# Altium schematic sheet 1608卡-原理图3.SchDoc
size A3
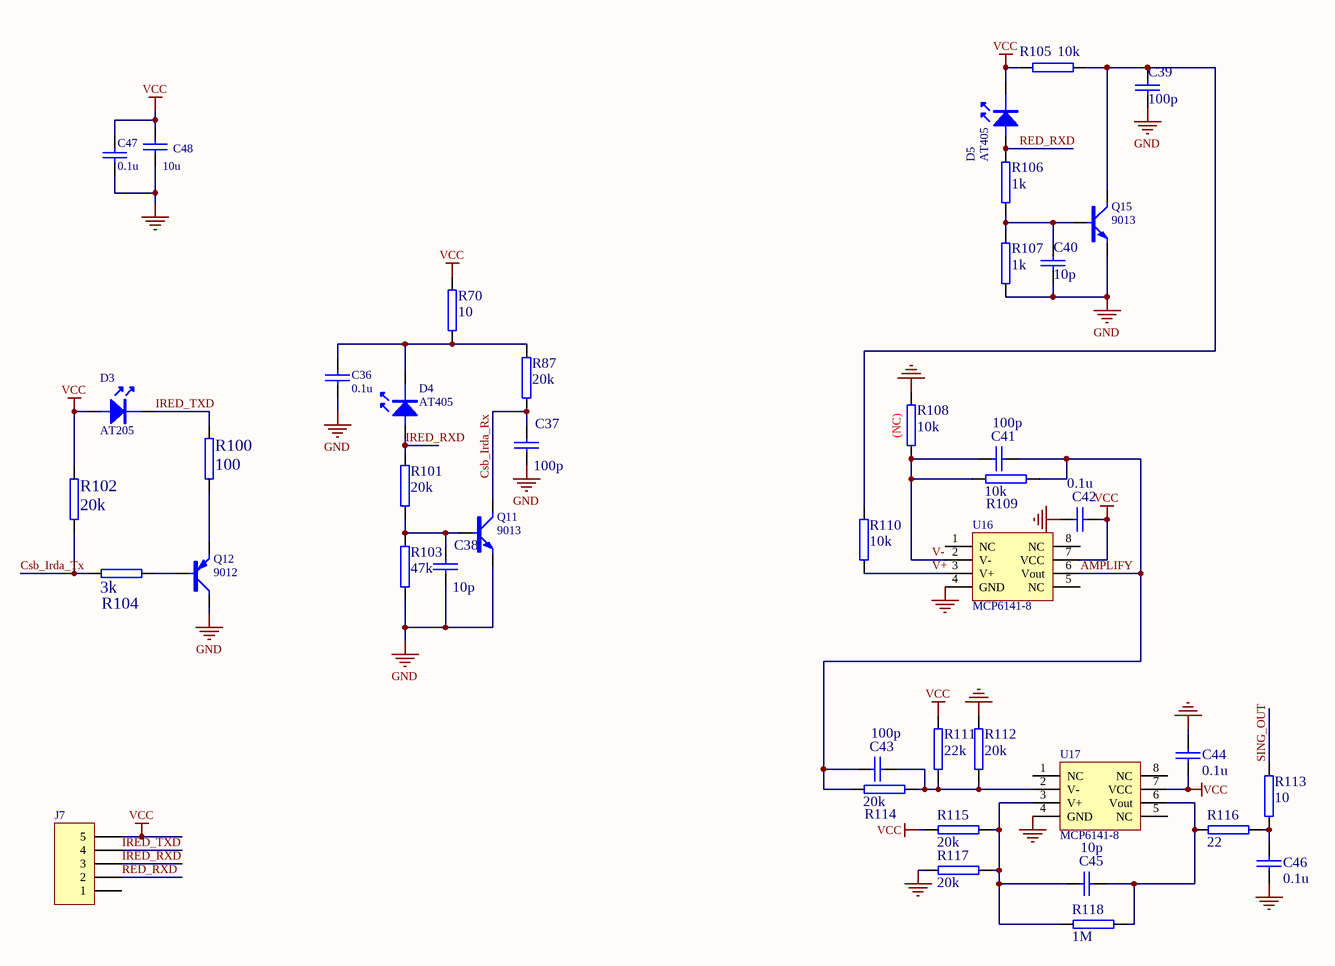
[diagram p0: 1608卡-原理图3.SchDoc]

## Parts
C36  0.1u  [C0603]
C37  100p  [C0603]
C38  10p  [C0603]
C39  100p  [C0603]
C40  10p  [C0603]
C41  100p  [C0603]
C42  0.1u  [C0603]
C43  100p  [C0603]
C44  0.1u  [C0603]
C45  10p  [C0603]
C46  0.1u  [C0603]
C47  0.1u  [C0603]
C48  10u  [C0603]
D3  AT205  [LEDRED]
D4  AT405  [LEDRED]
D5  AT405  [LEDRED]
J7  TEM  [JP5]  (value not drawn)
Q11  9013  [SOT-23-TRAN]
Q12  9012  [SOT23-9013]
Q15  9013  [SOT-23-TRAN]
R70  10  [R0603]
R87  20k  [R0603]
R100  100  [R0603]
R101  20k  [R0603]
R102  20k  [R0603]
R103  47k  [R0603]
R104  3k  [R0603]
R105  10k  [R0603]
R106  1k  [R0603]
R107  1k  [R0603]
R108  10k  [R0603]
R109  10k  [R0603]
R110  10k  [R0603]
R111  22k  [R0603]
R112  20k  [R0603]
R113  10  [R0603]
R114  20k  [R0603]
R115  20k  [R0603]
R116  22  [R0603]
R117  20k  [R0603]
R118  1M  [R0603]
U16  MCP6141-8  [SO-8]
U17  MCP6141-8  [SO-8]

## Nets
GND: C36.1 C37.2 C38.2 C39.2 C40.2 C42.2 C44.2 C46.2 C47.2 C48.2 Q11.E Q12.3(C) Q15.E R103.2 R107.1 R108.2 R112.2 R117.2 U16.4(GND) U17.4(GND)
VCC: C42.1 C44.1 C47.1 C48.1 D3.1 D5.2 J7.5 R70.2 R102.1 R105.2 R111.2 R115.2 U16.7(VCC) U17.7(VCC)
AMPLIFY: C41.1 C43.2 R109.2 R114.1 U16.6(Vout)
Csb_Irda_Rx: C37.1 Q11.C R87.1
Csb_Irda_Tx: R102.2 R104.2
IRED_RXD: D4.1 J7.3 R101.1
IRED_TXD: D3.2 J7.4 R100.1
RED_RXD: D5.1 J7.2 R106.1
SING_OUT: R113.1
V+: R110.2 U16.3(V+)
V-: C41.2 R108.1 R109.1 U16.2(V-)
NetC36_2: C36.2 D4.2 R70.1 R87.2
NetC38_1: C38.1 Q11.B R101.2 R103.1
NetC39_1: C39.1 Q15.C R105.1 R110.1
NetC40_1: C40.1 Q15.B R106.2 R107.2
NetC43_1: C43.1 R111.1 R112.1 R114.2 U17.2(V-)
NetC45_1: C45.1 R116.2 R118.1 U17.6(Vout)
NetC45_2: C45.2 R115.1 R117.1 R118.2 U17.3(V+)
NetC46_1: C46.1 R113.2 R116.1
NetQ12_1: Q12.1(E) R100.2
NetQ12_2: Q12.2(B) R104.1

Not connected (* = marked no-connect by the designer): J7 1; U16 1(NC) 5(NC) 8(NC); U17 1(NC) 5(NC) 8(NC)

## Notes on the sheet
- (near R108) (NC)

## Library data of the parts
C36 C47 C48 = CAP: 无极性电容
C37-C46 = CAP: Capacitor
D3-D5 = LED-5
J7 = Header 5: Header, 5-Pin; LatestRevisionDate: 17-Jul-2002; LatestRevisionNote: Re-released for DXP Platform.; Publisher: Altium Limited
Q11 Q15 = NPN-S: NPN Transistor
R70 R87 R101 R103 R105-R118 = RES11
R100 R102 R104 = Pro28.tmp_UnNamed_37